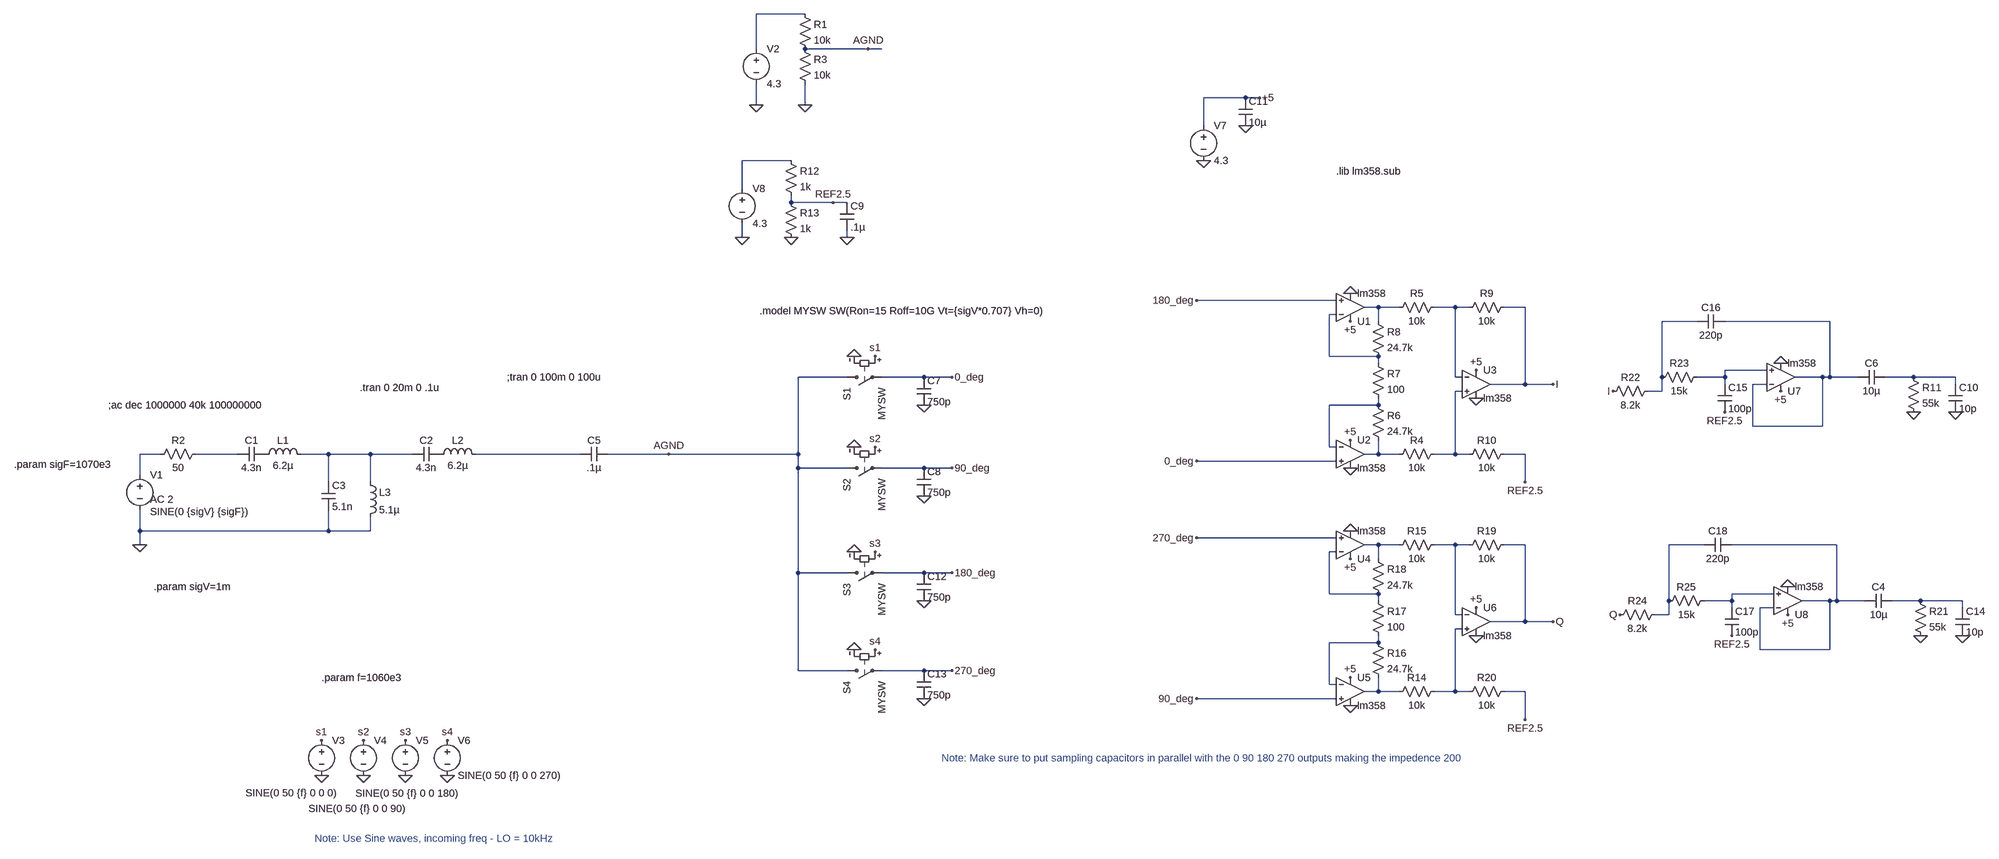
[diagram p0: schematic Receiver.asc]
Receiver.asc, the LTspice schematic file:
Version 4
SHEET 1 5288 680
WIRE 1760 -2160 1648 -2160
WIRE 1648 -2080 1648 -2160
WIRE 1904 -2080 1760 -2080
WIRE 1936 -2080 1904 -2080
WIRE 2768 -1968 2672 -1968
WIRE 2800 -1968 2768 -1968
WIRE 1648 -1952 1648 -2000
WIRE 1760 -1952 1760 -2000
WIRE 2672 -1904 2672 -1968
WIRE 1728 -1824 1616 -1824
WIRE 1616 -1760 1616 -1824
WIRE 1728 -1728 1728 -1744
WIRE 1824 -1728 1728 -1728
WIRE 1856 -1728 1824 -1728
WIRE 1616 -1648 1616 -1680
WIRE 1856 -1648 1856 -1664
WIRE 2976 -1504 2656 -1504
WIRE 3072 -1488 3040 -1488
WIRE 3120 -1488 3072 -1488
WIRE 3248 -1488 3200 -1488
WIRE 3280 -1488 3248 -1488
WIRE 3408 -1488 3360 -1488
WIRE 2976 -1472 2960 -1472
WIRE 3072 -1456 3072 -1488
WIRE 4128 -1456 4048 -1456
WIRE 4432 -1456 4192 -1456
WIRE 2960 -1376 2960 -1472
WIRE 3072 -1376 2960 -1376
WIRE 3072 -1360 3072 -1376
WIRE 4288 -1344 4192 -1344
WIRE 1856 -1328 1744 -1328
WIRE 2032 -1328 1936 -1328
WIRE 2096 -1328 2032 -1328
WIRE 3248 -1328 3248 -1488
WIRE 3264 -1328 3248 -1328
WIRE 4048 -1328 4048 -1456
WIRE 4192 -1328 4192 -1344
WIRE 4192 -1328 4128 -1328
WIRE 4416 -1328 4352 -1328
WIRE 4432 -1328 4432 -1456
WIRE 4432 -1328 4416 -1328
WIRE 4496 -1328 4432 -1328
WIRE 4624 -1328 4560 -1328
WIRE 4720 -1328 4624 -1328
WIRE 3408 -1312 3408 -1488
WIRE 3408 -1312 3328 -1312
WIRE 3472 -1312 3408 -1312
WIRE 4192 -1312 4192 -1328
WIRE 4288 -1312 4256 -1312
WIRE 4720 -1312 4720 -1328
WIRE 3264 -1296 3248 -1296
WIRE 4048 -1296 4048 -1328
WIRE 4048 -1296 4016 -1296
WIRE 3072 -1264 3072 -1280
WIRE 3072 -1264 2960 -1264
WIRE 4256 -1216 4256 -1312
WIRE 4416 -1216 4416 -1328
WIRE 4416 -1216 4256 -1216
WIRE 2960 -1168 2960 -1264
WIRE 2976 -1168 2960 -1168
WIRE 0 -1152 -48 -1152
WIRE 176 -1152 80 -1152
WIRE 384 -1152 320 -1152
WIRE 480 -1152 384 -1152
WIRE 576 -1152 480 -1152
WIRE 960 -1152 720 -1152
WIRE 1328 -1152 1024 -1152
WIRE 1744 -1152 1744 -1328
WIRE 1744 -1152 1328 -1152
WIRE 3072 -1152 3072 -1184
WIRE 3072 -1152 3040 -1152
WIRE 3120 -1152 3072 -1152
WIRE 3248 -1152 3248 -1296
WIRE 3248 -1152 3200 -1152
WIRE 3280 -1152 3248 -1152
WIRE 3408 -1152 3360 -1152
WIRE 2976 -1136 2656 -1136
WIRE 1744 -1120 1744 -1152
WIRE 1856 -1120 1744 -1120
WIRE 2032 -1120 1936 -1120
WIRE 2096 -1120 2032 -1120
WIRE -48 -1104 -48 -1152
WIRE 384 -1088 384 -1152
WIRE 480 -1088 480 -1152
WIRE 3408 -1088 3408 -1152
WIRE -48 -976 -48 -1024
WIRE 384 -976 384 -1024
WIRE 384 -976 -48 -976
WIRE 480 -976 480 -1008
WIRE 480 -976 384 -976
WIRE 2976 -960 2656 -960
WIRE -48 -944 -48 -976
WIRE 3072 -944 3040 -944
WIRE 3120 -944 3072 -944
WIRE 3248 -944 3200 -944
WIRE 3280 -944 3248 -944
WIRE 3408 -944 3360 -944
WIRE 4144 -944 4064 -944
WIRE 4448 -944 4208 -944
WIRE 2976 -928 2960 -928
WIRE 3072 -912 3072 -944
WIRE 1744 -880 1744 -1120
WIRE 1856 -880 1744 -880
WIRE 2032 -880 1936 -880
WIRE 2096 -880 2032 -880
WIRE 2960 -832 2960 -928
WIRE 3072 -832 2960 -832
WIRE 4304 -832 4208 -832
WIRE 3072 -816 3072 -832
WIRE 4064 -816 4064 -944
WIRE 4208 -816 4208 -832
WIRE 4208 -816 4144 -816
WIRE 4432 -816 4368 -816
WIRE 4448 -816 4448 -944
WIRE 4448 -816 4432 -816
WIRE 4512 -816 4448 -816
WIRE 4640 -816 4576 -816
WIRE 4736 -816 4640 -816
WIRE 4208 -800 4208 -816
WIRE 4304 -800 4272 -800
WIRE 4736 -800 4736 -816
WIRE 3248 -784 3248 -944
WIRE 3264 -784 3248 -784
WIRE 4064 -784 4064 -816
WIRE 4064 -784 4032 -784
WIRE 3408 -768 3408 -944
WIRE 3408 -768 3328 -768
WIRE 3472 -768 3408 -768
WIRE 3264 -752 3248 -752
WIRE 3072 -720 3072 -736
WIRE 3072 -720 2960 -720
WIRE 4272 -704 4272 -800
WIRE 4432 -704 4432 -816
WIRE 4432 -704 4272 -704
WIRE 1744 -656 1744 -880
WIRE 1856 -656 1744 -656
WIRE 2032 -656 1936 -656
WIRE 2096 -656 2032 -656
WIRE 2960 -624 2960 -720
WIRE 2976 -624 2960 -624
WIRE 3072 -608 3072 -640
WIRE 3072 -608 3040 -608
WIRE 3120 -608 3072 -608
WIRE 3248 -608 3248 -752
WIRE 3248 -608 3200 -608
WIRE 3280 -608 3248 -608
WIRE 3408 -608 3360 -608
WIRE 2976 -592 2656 -592
WIRE 3408 -544 3408 -608
FLAG -48 -944 0
FLAG 1648 -1952 0
FLAG 1760 -1952 0
FLAG 1872 -928 0
FLAG 1872 -1168 0
FLAG 1872 -1376 0
FLAG 1872 -704 0
FLAG 368 -416 0
FLAG 464 -416 0
FLAG 560 -416 0
FLAG 656 -416 0
FLAG 368 -496 s1
FLAG 464 -496 s2
FLAG 560 -496 s3
FLAG 656 -496 s4
FLAG 1920 -1376 s1
FLAG 1920 -1168 s2
FLAG 1920 -928 s3
FLAG 1920 -704 s4
FLAG 2096 -1328 0_deg
FLAG 2096 -1120 90_deg
FLAG 2096 -880 180_deg
FLAG 2096 -656 270_deg
FLAG 1904 -2080 AGND
FLAG 2672 -1824 0
FLAG 2800 -1968 +5
FLAG 3008 -1456 +5
FLAG 3008 -1184 +5
FLAG 3008 -1520 0
FLAG 3008 -1120 0
FLAG 3296 -1280 0
FLAG 3296 -1344 +5
FLAG 2768 -1904 0
FLAG 2656 -1504 180_deg
FLAG 2656 -1136 0_deg
FLAG 4624 -1248 0
FLAG 3008 -912 +5
FLAG 3008 -640 +5
FLAG 3008 -976 0
FLAG 3008 -576 0
FLAG 3296 -736 0
FLAG 3296 -800 +5
FLAG 2656 -960 270_deg
FLAG 2656 -592 90_deg
FLAG 4640 -736 0
FLAG 2032 -592 0
FLAG 2032 -816 0
FLAG 2032 -1056 0
FLAG 2032 -1264 0
FLAG 1328 -1152 AGND
FLAG 3408 -544 REF2.5
FLAG 3408 -1088 REF2.5
FLAG 1616 -1648 0
FLAG 1728 -1648 0
FLAG 1856 -1648 0
FLAG 1824 -1728 REF2.5
FLAG 4720 -1248 0
FLAG 4736 -736 0
FLAG 3472 -1312 I
FLAG 3472 -768 Q
FLAG 4320 -1296 +5
FLAG 4320 -1360 0
FLAG 4336 -784 +5
FLAG 4336 -848 0
FLAG 3936 -1296 I
FLAG 3952 -784 Q
FLAG 4208 -736 REF2.5
FLAG 4192 -1248 REF2.5
SYMBOL voltage -48 -1120 R0
WINDOW 3 24 100 Left 2
WINDOW 123 24 72 Left 2
WINDOW 39 0 0 Left 0
SYMATTR Value SINE(0 {sigV} {sigF})
SYMATTR Value2 AC 2
SYMATTR InstName V1
SYMBOL res 96 -1168 R90
WINDOW 0 0 56 VBottom 2
WINDOW 3 32 56 VTop 2
SYMATTR InstName R2
SYMATTR Value 50
SYMBOL cap 240 -1168 R90
WINDOW 0 0 32 VBottom 2
WINDOW 3 32 32 VTop 2
SYMATTR InstName C1
SYMATTR Value 4.3n
SYMBOL ind 224 -1136 R270
WINDOW 0 32 56 VTop 2
WINDOW 3 5 56 VBottom 2
SYMATTR InstName L1
SYMATTR Value 6.2µ
SYMBOL ind 624 -1136 R270
WINDOW 0 32 56 VTop 2
WINDOW 3 5 56 VBottom 2
SYMATTR InstName L2
SYMATTR Value 6.2µ
SYMBOL cap 640 -1168 R90
WINDOW 0 0 32 VBottom 2
WINDOW 3 32 32 VTop 2
SYMATTR InstName C2
SYMATTR Value 4.3n
SYMBOL cap 368 -1088 R0
SYMATTR InstName C3
SYMATTR Value 5.1n
SYMBOL ind 464 -1104 R0
SYMATTR InstName L3
SYMATTR Value 5.1µ
SYMBOL voltage 1648 -2096 R0
WINDOW 123 0 0 Left 0
WINDOW 39 0 0 Left 0
SYMATTR InstName V2
SYMATTR Value 4.3
SYMBOL res 1744 -2176 R0
SYMATTR InstName R1
SYMATTR Value 10k
SYMBOL res 1744 -2096 R0
SYMATTR InstName R3
SYMATTR Value 10k
SYMBOL sw 1840 -1328 M90
SYMATTR InstName S1
SYMATTR Value MYSW
SYMBOL sw 1840 -1120 M90
SYMATTR InstName S2
SYMATTR Value MYSW
SYMBOL sw 1840 -880 M90
SYMATTR InstName S3
SYMATTR Value MYSW
SYMBOL sw 1840 -656 M90
SYMATTR InstName S4
SYMATTR Value MYSW
SYMBOL voltage 368 -512 R0
WINDOW 3 -174 136 Left 2
WINDOW 123 0 0 Left 0
WINDOW 39 0 0 Left 0
SYMATTR Value SINE(0 50 {f} 0 0 0)
SYMATTR InstName V3
SYMBOL voltage 464 -512 R0
WINDOW 3 -126 172 Left 2
WINDOW 123 0 0 Left 0
WINDOW 39 0 0 Left 0
SYMATTR Value SINE(0 50 {f} 0 0 90)
SYMATTR InstName V4
SYMBOL voltage 560 -512 R0
WINDOW 3 -114 137 Left 2
WINDOW 123 0 0 Left 0
WINDOW 39 0 0 Left 0
SYMATTR Value SINE(0 50 {f} 0 0 180)
SYMATTR InstName V5
SYMBOL voltage 656 -512 R0
WINDOW 123 0 0 Left 0
WINDOW 39 0 0 Left 0
SYMATTR InstName V6
SYMATTR Value SINE(0 50 {f} 0 0 270)
SYMBOL Opamps\\opamp2 3008 -1424 M180
SYMATTR InstName U1
SYMATTR Value lm358
SYMBOL Opamps\\opamp2 3008 -1216 R0
SYMATTR InstName U2
SYMATTR Value lm358
SYMBOL res 3216 -1168 R90
WINDOW 0 0 56 VBottom 2
WINDOW 3 32 56 VTop 2
SYMATTR InstName R4
SYMATTR Value 10k
SYMBOL res 3216 -1504 R90
WINDOW 0 0 56 VBottom 2
WINDOW 3 32 56 VTop 2
SYMATTR InstName R5
SYMATTR Value 10k
SYMBOL res 3056 -1280 R0
SYMATTR InstName R6
SYMATTR Value 24.7k
SYMBOL res 3056 -1376 R0
SYMATTR InstName R7
SYMATTR Value 100
SYMBOL res 3056 -1472 R0
SYMATTR InstName R8
SYMATTR Value 24.7k
SYMBOL res 3376 -1504 R90
WINDOW 0 0 56 VBottom 2
WINDOW 3 32 56 VTop 2
SYMATTR InstName R9
SYMATTR Value 10k
SYMBOL res 3376 -1168 R90
WINDOW 0 0 56 VBottom 2
WINDOW 3 32 56 VTop 2
SYMATTR InstName R10
SYMATTR Value 10k
SYMBOL voltage 2672 -1920 R0
WINDOW 123 0 0 Left 0
WINDOW 39 0 0 Left 0
SYMATTR InstName V7
SYMATTR Value 4.3
SYMBOL cap 2752 -1968 R0
SYMATTR InstName C11
SYMATTR Value 10µ
SYMBOL res 4608 -1344 R0
SYMATTR InstName R11
SYMATTR Value 55k
SYMBOL Opamps\\opamp2 3008 -880 M180
SYMATTR InstName U4
SYMATTR Value lm358
SYMBOL Opamps\\opamp2 3008 -672 R0
SYMATTR InstName U5
SYMATTR Value lm358
SYMBOL res 3216 -624 R90
WINDOW 0 0 56 VBottom 2
WINDOW 3 32 56 VTop 2
SYMATTR InstName R14
SYMATTR Value 10k
SYMBOL res 3216 -960 R90
WINDOW 0 0 56 VBottom 2
WINDOW 3 32 56 VTop 2
SYMATTR InstName R15
SYMATTR Value 10k
SYMBOL res 3056 -736 R0
SYMATTR InstName R16
SYMATTR Value 24.7k
SYMBOL res 3056 -832 R0
SYMATTR InstName R17
SYMATTR Value 100
SYMBOL res 3056 -928 R0
SYMATTR InstName R18
SYMATTR Value 24.7k
SYMBOL res 3376 -960 R90
WINDOW 0 0 56 VBottom 2
WINDOW 3 32 56 VTop 2
SYMATTR InstName R19
SYMATTR Value 10k
SYMBOL res 3376 -624 R90
WINDOW 0 0 56 VBottom 2
WINDOW 3 32 56 VTop 2
SYMATTR InstName R20
SYMATTR Value 10k
SYMBOL res 4624 -832 R0
SYMATTR InstName R21
SYMATTR Value 55k
SYMBOL cap 2016 -1328 R0
SYMATTR InstName C7
SYMATTR Value 750p
SYMBOL cap 2016 -1120 R0
SYMATTR InstName C8
SYMATTR Value 750p
SYMBOL cap 2016 -880 R0
SYMATTR InstName C12
SYMATTR Value 750p
SYMBOL cap 2016 -656 R0
SYMATTR InstName C13
SYMATTR Value 750p
SYMBOL cap 1024 -1168 R90
WINDOW 0 0 32 VBottom 2
WINDOW 3 32 32 VTop 2
SYMATTR InstName C5
SYMATTR Value .1µ
SYMBOL cap 4576 -832 R90
WINDOW 0 0 32 VBottom 2
WINDOW 3 32 32 VTop 2
SYMATTR InstName C4
SYMATTR Value 10µ
SYMBOL cap 4560 -1344 R90
WINDOW 0 0 32 VBottom 2
WINDOW 3 32 32 VTop 2
SYMATTR InstName C6
SYMATTR Value 10µ
SYMBOL voltage 1616 -1776 R0
WINDOW 123 0 0 Left 0
WINDOW 39 0 0 Left 0
SYMATTR InstName V8
SYMATTR Value 4.3
SYMBOL res 1712 -1840 R0
SYMATTR InstName R12
SYMATTR Value 1k
SYMBOL res 1712 -1744 R0
SYMATTR InstName R13
SYMATTR Value 1k
SYMBOL cap 1840 -1728 R0
SYMATTR InstName C9
SYMATTR Value .1µ
SYMBOL cap 4704 -1312 R0
SYMATTR InstName C10
SYMATTR Value 10p
SYMBOL cap 4720 -800 R0
SYMATTR InstName C14
SYMATTR Value 10p
SYMBOL res 4032 -1312 R90
WINDOW 0 0 56 VBottom 2
WINDOW 3 32 56 VTop 2
SYMATTR InstName R22
SYMATTR Value 8.2k
SYMBOL res 4144 -1344 R90
WINDOW 0 0 56 VBottom 2
WINDOW 3 32 56 VTop 2
SYMATTR InstName R23
SYMATTR Value 15k
SYMBOL cap 4176 -1312 R0
SYMATTR InstName C15
SYMATTR Value 100p
SYMBOL cap 4192 -1472 R90
WINDOW 0 0 32 VBottom 2
WINDOW 3 32 32 VTop 2
SYMATTR InstName C16
SYMATTR Value 220p
SYMBOL res 4048 -800 R90
WINDOW 0 0 56 VBottom 2
WINDOW 3 32 56 VTop 2
SYMATTR InstName R24
SYMATTR Value 8.2k
SYMBOL res 4160 -832 R90
WINDOW 0 0 56 VBottom 2
WINDOW 3 32 56 VTop 2
SYMATTR InstName R25
SYMATTR Value 15k
SYMBOL cap 4192 -800 R0
SYMATTR InstName C17
SYMATTR Value 100p
SYMBOL cap 4208 -960 R90
WINDOW 0 0 32 VBottom 2
WINDOW 3 32 32 VTop 2
SYMATTR InstName C18
SYMATTR Value 220p
SYMBOL Opamps\\opamp2 3296 -1376 R0
SYMATTR InstName U3
SYMATTR Value lm358
SYMBOL Opamps\\opamp2 3296 -832 R0
SYMATTR InstName U6
SYMATTR Value lm358
SYMBOL Opamps\\opamp2 4320 -1264 M180
SYMATTR InstName U7
SYMATTR Value lm358
SYMBOL Opamps\\opamp2 4336 -752 M180
SYMATTR InstName U8
SYMATTR Value lm358
TEXT -120 -1264 Left 2 !;ac dec 1000000 40k 100000000
TEXT 456 -1304 Left 2 !.tran 0 20m 0 .1u
TEXT 1656 -1480 Left 2 !.model MYSW SW(Ron=15 Roff=10G Vt={sigV*0.707} Vh=0)
TEXT 368 -640 Left 2 !.param f=1060e3
TEXT 2976 -1800 Left 2 !.lib lm358.sub
TEXT -336 -1128 Left 2 !.param sigF=1070e3
TEXT 2072 -456 Left 2 ;Note: Make sure to put sampling capacitors in parallel with the 0 90 180 270 outputs making the impedence 200
TEXT 352 -272 Left 2 ;Note: Use Sine waves, incoming freq - LO = 10kHz
TEXT 792 -1328 Left 2 !;tran 0 100m 0 100u
TEXT -16 -848 Left 2 !.param sigV=1m

The netlist it stands for:
* Receiver.asc
V1 N012 0 SINE(0 {sigV} {sigF}) AC 2
R2 N013 N012 50
C1 P001 N013 4.3n
L1 P001 N014 6.2µ
L2 P002 N015 6.2µ
C2 P002 N014 4.3n
C3 N014 0 5.1n
L3 N014 0 5.1µ
V2 N001 0 4.3
R1 N001 AGND 10k
R3 AGND 0 10k
S1 AGND 0_deg s1 0 MYSW
S2 AGND 90_deg s2 0 MYSW
S3 AGND 180_deg s3 0 MYSW
S4 AGND 270_deg s4 0 MYSW
V3 s1 0 SINE(0 50 {f} 0 0 0)
V4 s2 0 SINE(0 50 {f} 0 0 90)
V5 s3 0 SINE(0 50 {f} 0 0 180)
V6 s4 0 SINE(0 50 {f} 0 0 270)
XU1 180_deg N005 +5 0 N003 lm358  ; pins In+ In- V+ V- OUT
XU2 0_deg N011 +5 0 N016 lm358  ; pins In+ In- V+ V- OUT
R4 N010 N016 10k
R5 N004 N003 10k
R6 N011 N016 24.7k
R7 N005 N011 100
R8 N003 N005 24.7k
R9 I N004 10k
R10 REF2.5 N010 10k
V7 +5 0 4.3
C11 +5 0 10µ
R11 N009 0 55k
XU4 270_deg N021 +5 0 N017 lm358  ; pins In+ In- V+ V- OUT
XU5 90_deg N025 +5 0 N026 lm358  ; pins In+ In- V+ V- OUT
R14 N024 N026 10k
R15 N018 N017 10k
R16 N025 N026 24.7k
R17 N021 N025 100
R18 N017 N021 24.7k
R19 Q N018 10k
R20 REF2.5 N024 10k
R21 N023 0 55k
C7 0_deg 0 750p
C8 90_deg 0 750p
C12 180_deg 0 750p
C13 270_deg 0 750p
C5 AGND N015 .1µ
C4 N023 N020 10µ
C6 N009 N007 10µ
V8 N002 0 4.3
R12 N002 REF2.5 1k
R13 REF2.5 0 1k
C9 REF2.5 0 .1µ
C10 N009 0 10p
C14 N023 0 10p
R22 N006 I 8.2k
R23 N008 N006 15k
C15 N008 REF2.5 100p
C16 N007 N006 220p
R24 N019 Q 8.2k
R25 N022 N019 15k
C17 N022 REF2.5 100p
C18 N020 N019 220p
XU3 N010 N004 +5 0 I lm358  ; pins In+ In- V+ V- OUT
XU6 N024 N018 +5 0 Q lm358  ; pins In+ In- V+ V- OUT
XU7 N008 N007 +5 0 N007 lm358  ; pins In+ In- V+ V- OUT
XU8 N022 N020 +5 0 N020 lm358  ; pins In+ In- V+ V- OUT
;ac dec 1000000 40k 100000000
.tran 0 20m 0 .1u
.model MYSW SW(Ron=15 Roff=10G Vt={sigV*0.707} Vh=0)
.param f=1060e3
.lib lm358.sub
.param sigF=1070e3
* Note: Make sure to put sampling capacitors in parallel with the 0 90 180 270 outputs making the impedence 200
* Note: Use Sine waves, incoming freq - LO = 10kHz
;tran 0 100m 0 100u
.param sigV=1m
.backanno
.end